# Altium schematic sheet Simple LED-driver on BP2857d.SchDoc
size 420 x 297 mm; CheckedBy: Lazarev; DrawnBy: Lazarev; SheetTotal: 1; PageSetup: Record=PageOptions|CenterHorizontal=True|CenterVertical=True|PrintScale=0.98|XCorrection=1.00|YCorrection=1.00|PrintKind=0|BorderSize=5000000|LeftOffset=0|BottomOffset=0|Orientation=2|PaperLength=1000|PaperWidth=1000|Scale=100|PaperSource=260|PrintQuality=600|MediaType=1|DitherType=10|PrintScaleMode=1|PaperKind=A3
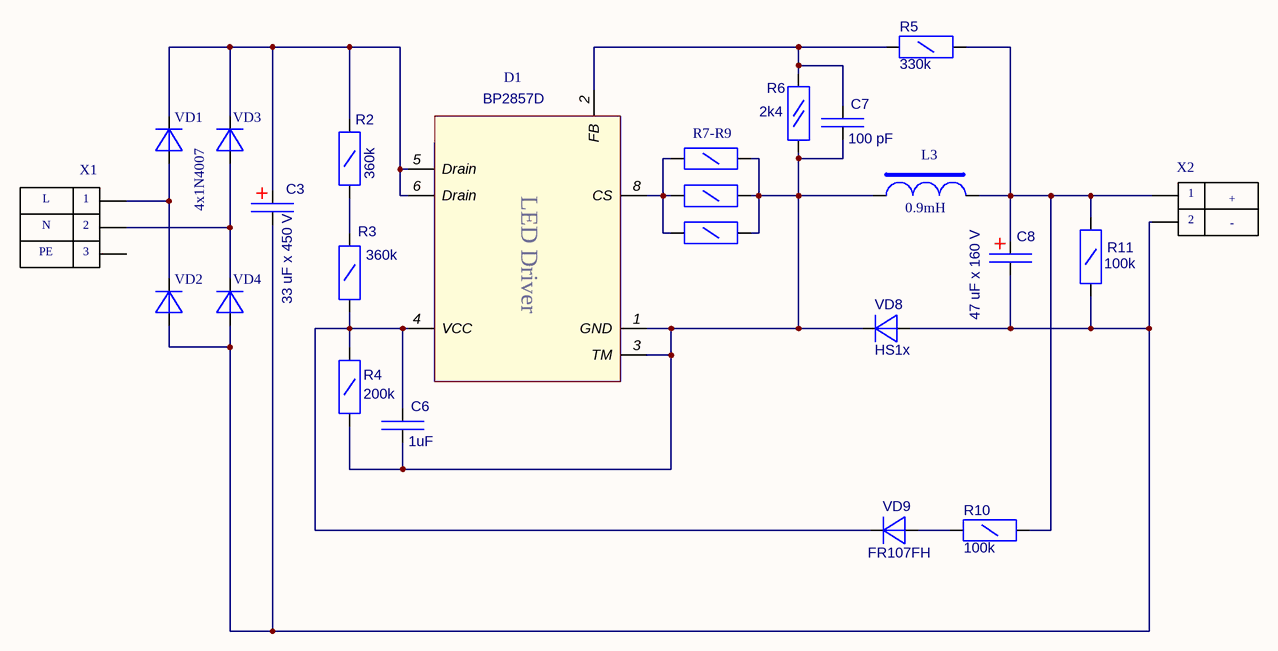
[diagram p0: Simple LED-driver on BP2857d.SchDoc]

## Parts
C3  value 33 uF x 450 V  [CAPR E 12.5x20, pitch 5mm; hor.]  (hidden comment: Cap Pol)
C6  value 1uF  [CAPC2012 (0805)]  (hidden comment: Cap_SMD)
C7  value 100 pF  [CAPC2012 (0805)]  (hidden comment: Cap_SMD)
C8  value 47 uF x 160 V  [CAPR E 10x12.5 pitch 5 - hor]  (hidden comment: Cap Pol)
D1  value BP2857D  (hidden comment: BP2857D (DIP7))
L3  Value2: 0.9mH  [VRI-E16-8-G]  (hidden comment: LED-E16-0.9mH-0.5g-H)
R2  value 360k  [RESC3216(1206)N]  (hidden comment: Res 1/4W)
R3  value 360k  [RESC3216(1206)N]  (hidden comment: Res 1/4W)
R4  value 200k  [RESC3216(1206)N]  (hidden comment: Res 1/4W)
R5  value 330k  [RESC3216(1206)N]  (hidden comment: Res 1/4W)
R6  value 2k4  [RESC2012(0805)]  (hidden comment: Res 1/8W)
R7  Designator2: R7-R9  [RESC3216(1206)N]  (hidden comment: Res 1/4W)
R8  Res 1/4W  [RESC3216(1206)N]  (value not drawn)
R9  Res 1/4W  [RESC3216(1206)N]  (value not drawn)
R10  value 100k  [RESC3216(1206)N]  (hidden comment: Res 1/4W)
R11  value 100k  [RESC3216(1206)N]  (hidden comment: Res 1/4W)
VD1  Value2: 4x1N4007  [CD4532-1812 (mod)]
VD2  (no value)  [CD4532-1812 (mod)]
VD3  Diode HS1x  [CD4532-1812 (mod)]  (value not drawn)
VD4  (no value)  [CD4532-1812 (mod)]
VD8  value HS1x  [CD4532-1812 (mod)]  (hidden comment: Diode HS1x)
VD9  value FR107FH  (hidden comment: Diode HS1x)
X1  Connector_3_pin  [ZIP-Ballast3]  (value not drawn)
X2  Connector_output_2pin_nobody  [ZIP-Ballast2]  (value not drawn)

## Nets
NetC3_1: C3.1 D1.5(Drain) D1.6(Drain) R2.2 VD1.2 VD3.2
NetC3_2: C3.2 C8.2 R11.1 VD2.1 VD4.1 VD8.1 X2.2
NetC6_1: C6.1 D1.4(VCC) R3.1 R4.2 VD9.2
NetC6_2: C6.2 C7.2 D1.1(GND) D1.3(TM) L3.14(Pri+) R4.1 R6.2 R7.1 R8.1 R9.1 VD8.2
NetC7_1: C7.1 D1.2(FB) R5.2 R6.1
NetC8_1: C8.1 L3.1(Pri-) R5.1 R10.1 R11.2 X2.1
NetD1_8: D1.8(CS) R7.2 R8.2 R9.2
NetR2_1: R2.1 R3.2
NetR10_2: R10.2 VD9.1
NetVD1_1: VD1.1 VD2.2 X1.1
NetVD3_1: VD3.1 VD4.2 X1.2

Not connected (* = marked no-connect by the designer): X1 3

## Notes on the sheet
- Подп. дата
- Инв. № дубл.
- Взам. инв. №
- Подп. и дата
- Изм.
- Лист.
- № докум.
- Подп.
- Дата
- Лит.
- Масса
- Масштаб
- Разраб.
- Пров.
- Т. контр.
- Лист 1
- Листов
- 1:1
- Инв. № подп.
- Н. контр.
- Утв.
- (in symbol BP2857D (DIP7)) LED Driver
- (in symbol Connector_3_pin) L; N; PE
- (in symbol Connector_output_2pin_nobody) +; -

## Library data of the parts
C3 C8 = Cap Pol: Cap Pol GOST; Tolerance: 10%; Function: Electrolytic Aluminum Capasitor; Supplier: *
  C3: PackageDescription: Radial, Thru-Hole Body 13.0x25.0 (DxH)mm, Pin Spacing 5.0mm
  C8: PackageDescription: Radial, Thru-Hole Body 10.0x18.0 (DxH)mm, Pin Spacing 5.0mm
C6 C7 = Cap_SMD: Ceramic; Voltage: 25V; Tolerance %: 10%; Dielectric: X7R; PackageDescription: SMD CC0805; Function: *; Supplier: *; Supplier Part Number: *
D1 = BP2857D (DIP7): IC LED Driver Buck; Functuion: LED-Driver Controller; PackageReference: DIP7; Supplier 1: BPS; Supplier 2: Digi-Key
L3 = Choke LED E16: LED.E16-30mH-0.5g.H; Function: Choke Ballast; PackageDescription: EVD25-13; Value: LED-E16-0.9mH-0.5g-H
R2-R5 R10 R11 = Res 1/4W: Resistor GOST; Tolerance: 5%; Voltage: 200Vdc; PackageDescription: Chip Resistor, Body 3.2x1.6mm,; PackageReference: *; Function: *; Part Number: *
R6 = Res 1/8W: Resistor GOST; Tolerance: 5%; PackageDescription: Chip Resistor, Body 2.0x1.3mm,; PackageReference: *; Part Number: *
R7-R9 = Res 1/4W: Resistor GOST; Value: 1R6; Tolerance: 5%; Voltage: 200Vdc; PackageDescription: Chip Resistor, Body 3.2x1.6mm,; PackageReference: *; Function: *; Part Number: *
VD1-VD4 = Diode1: Diode GOST; Function: Rectifier diode; Value: 1N4007; Part Number: *; PackageDescription: Chip Diode; Body 4.5 x 3.2 mm (LxW typ); PackageReference: *
VD8 = Diode HS1x: Diode HS1x (GOST); Package Description: Chip Diode; Body 4.5 x 3.2 mm (LxW typ); Part Number: *; Function: *
VD9 = Diode HS1x: Diode HS1x (GOST); Manufacturer: KEXIN; Function: Fast Diode; SMD Code: F7; Package Description: Chip Diode; Body 2.9 x 1.8 x 1.0 mm (LxWxH typ); Part Number: *; PackageReference: SOD-123